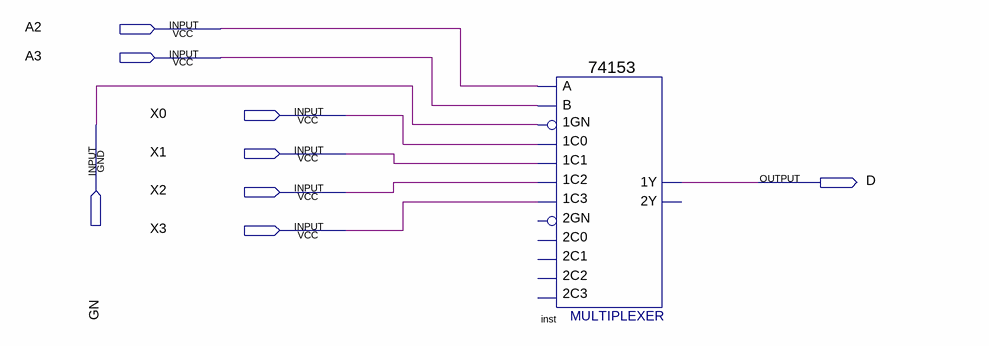
[diagram p0: schematic sheet]
// Quartus schematic exercicio_5.bdf as structural Verilog: 1 symbols, 8 pins
module exercicio_5 (
  input  A2,
  input  A3,
  input  X0,
  input  GN,
  input  X1,
  input  X2,
  input  X3,
  output D
);

  \74153  inst (
    .\1C1 (X1), .\1GN (GN), .\1C0 (X0), .\1C2 (X2), .\1C3 (X3), .B(A3), .A(A2), .\1Y (D));  // open: 2C0, 2GN, 2C2, 2C1, 2C3, 2Y
endmodule
